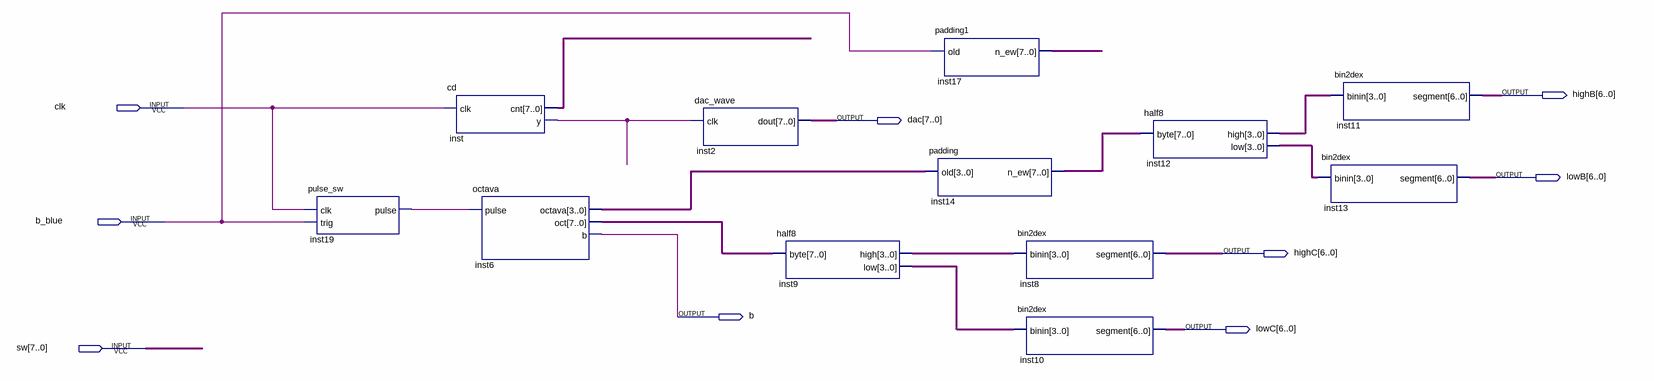
[diagram p0: schematic sheet]
// Quartus schematic DAC_SW.bdf as structural Verilog: 12 symbols, 9 pins
module DAC_SW (
  input  clk,
  input  b_blue,
  input  [7:0] sw,
  output [6:0] highB,
  output [7:0] dac,
  output [6:0] lowB,
  output [6:0] highC,
  output b,
  output [6:0] lowC
);

  wire inst19_pulse, inst_y;
  wire [3:0] inst6_octava, inst9_high, inst9_low, inst12_high, inst12_low;
  wire [7:0] inst6_oct, inst14_n_ew, inst17_n_ew, inst_cnt;

  pulse_sw inst19 (.clk(clk), .trig(b_blue), .pulse(inst19_pulse));
  cd inst (.clk(clk), .cnt(inst_cnt), .y(inst_y));
  octava inst6 (.pulse(inst19_pulse), .octava(inst6_octava), .oct(inst6_oct), .b(b));
  dac_wave inst2 (.clk(inst_y), .dout(dac));
  half8 inst9 (.\byte (inst6_oct), .high(inst9_high), .low(inst9_low));
  padding1 inst17 (.old(b_blue), .n_ew(inst17_n_ew));
  padding inst14 (.old(inst6_octava), .n_ew(inst14_n_ew));
  bin2dex inst8 (.binin(inst9_high), .segment(highC));
  bin2dex inst10 (.binin(inst9_low), .segment(lowC));
  half8 inst12 (.\byte (inst14_n_ew), .high(inst12_high), .low(inst12_low));
  bin2dex inst11 (.binin(inst12_high), .segment(highB));
  bin2dex inst13 (.binin(inst12_low), .segment(lowB));
endmodule
